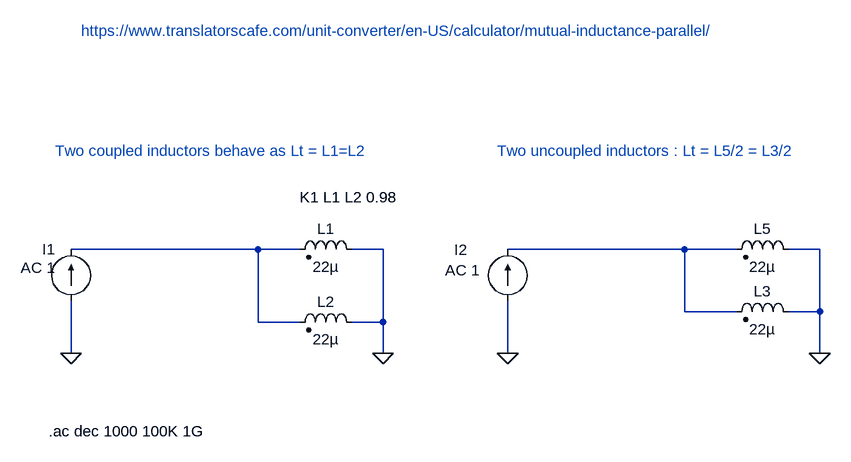
[diagram p0: schematic coupledInductors.asc]
coupledInductors.asc, the LTspice schematic file:
Version 4
SHEET 1 948 680
WIRE 64 -112 -224 -112
WIRE 128 -112 64 -112
WIRE 256 -112 208 -112
WIRE 720 -112 448 -112
WIRE 800 -112 720 -112
WIRE 928 -112 880 -112
WIRE 720 -16 720 -112
WIRE 800 -16 720 -16
WIRE 928 -16 928 -112
WIRE 928 -16 880 -16
WIRE 64 0 64 -112
WIRE 128 0 64 0
WIRE 256 0 256 -112
WIRE 256 0 208 0
WIRE -224 48 -224 -32
WIRE 256 48 256 0
WIRE 448 48 448 -32
WIRE 928 48 928 -16
FLAG -224 48 0
FLAG 256 48 0
FLAG 448 48 0
FLAG 928 48 0
SYMBOL ind2 224 -96 M270
WINDOW 0 32 56 VTop 2
WINDOW 3 5 56 VBottom 2
SYMATTR InstName L1
SYMATTR Value 22µ
SYMATTR Type ind
SYMATTR SpiceLine Rser=0
SYMBOL ind2 224 16 M270
WINDOW 0 32 56 VTop 2
WINDOW 3 5 56 VBottom 2
SYMATTR InstName L2
SYMATTR Value 22µ
SYMATTR Type ind
SYMATTR SpiceLine Rser=0
SYMBOL current -224 -32 R180
WINDOW 0 24 80 Left 2
WINDOW 3 24 0 Left 2
WINDOW 123 24 52 Left 2
WINDOW 39 0 0 Left 0
SYMATTR InstName I1
SYMATTR Value ""
SYMATTR Value2 AC 1
SYMBOL ind2 896 -96 M270
WINDOW 0 32 56 VTop 2
WINDOW 3 5 56 VBottom 2
SYMATTR InstName L5
SYMATTR Value 22µ
SYMATTR Type ind
SYMATTR SpiceLine Rser=0
SYMBOL current 448 -32 R180
WINDOW 0 62 79 Left 2
WINDOW 3 24 0 Left 2
WINDOW 123 43 48 Left 2
WINDOW 39 0 0 Left 0
SYMATTR InstName I2
SYMATTR Value ""
SYMATTR Value2 AC 1
SYMBOL ind2 896 0 M270
WINDOW 0 32 56 VTop 2
WINDOW 3 5 56 VBottom 2
SYMATTR InstName L3
SYMATTR Value 22µ
SYMATTR Type ind
SYMATTR SpiceLine Rser=0
TEXT 128 -192 Left 2 !K1 L1 L2 0.98
TEXT -258 168 Left 2 !.ac dec 1000 100K 1G
TEXT -208 -448 Left 2 ;https://www.translatorscafe.com/unit-converter/en-US/calculator/mutual-inductance-parallel/
TEXT -248 -264 Left 2 ;Two coupled inductors behave as Lt = L1=L2
TEXT 432 -264 Left 2 ;Two uncoupled inductors : Lt = L5/2 = L3/2

The netlist it stands for:
* coupledInductors.asc
L1 0 N001 22µ Rser=0
L2 0 N001 22µ Rser=0
I1 0 N001 AC 1
L5 0 N002 22µ Rser=0
I2 0 N002 AC 1
L3 0 N002 22µ Rser=0
K1 L1 L2 0.98
.ac dec 1000 100K 1G
* https://www.translatorscafe.com/unit-converter/en-US/calculator/mutual-inductance-parallel/
* Two coupled inductors behave as Lt = L1=L2
* Two uncoupled inductors : Lt = L5/2 = L3/2
.backanno
.end